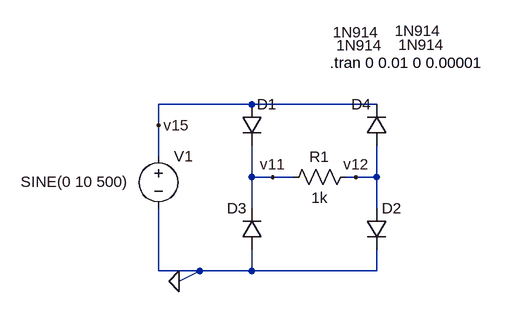
[diagram p0: schematic 20301378_Lab2_Full_Wave.asc]
20301378_Lab2_Full_Wave.asc, the LTspice schematic file:
Version 4
SHEET 1 880 680
WIRE 48 128 -96 128
WIRE 240 128 48 128
WIRE -96 160 -96 128
WIRE -96 208 -96 160
WIRE 48 240 48 192
WIRE 80 240 48 240
WIRE 112 240 80 240
WIRE 208 240 192 240
WIRE 240 240 240 192
WIRE 240 240 208 240
WIRE 48 288 48 240
WIRE 240 288 240 240
WIRE -96 384 -96 288
WIRE -32 384 -96 384
WIRE 48 384 48 352
WIRE 48 384 -32 384
WIRE 240 384 240 352
WIRE 240 384 48 384
WIRE -64 400 -32 384
FLAG -64 400 0
FLAG 80 240 v11
FLAG 208 240 v12
FLAG -96 160 v15
SYMBOL diode 32 128 R0
WINDOW 3 236 -113 Left 2
SYMATTR Value 1N914
SYMATTR InstName D1
SYMBOL diode 224 288 R0
WINDOW 3 -51 -271 Left 2
SYMATTR Value 1N914
SYMATTR InstName D2
SYMBOL diode 64 352 R180
WINDOW 0 24 64 Left 2
WINDOW 3 -185 315 Left 2
SYMATTR InstName D3
SYMATTR Value 1N914
SYMBOL diode 256 192 R180
WINDOW 0 24 64 Left 2
WINDOW 3 -89 156 Left 2
SYMATTR InstName D4
SYMATTR Value 1N914
SYMBOL res 96 256 R270
WINDOW 0 32 56 VTop 2
WINDOW 3 0 56 VBottom 2
SYMATTR InstName R1
SYMATTR Value 1k
SYMBOL voltage -96 192 R0
WINDOW 3 -212 55 Left 2
WINDOW 123 0 0 Left 0
WINDOW 39 0 0 Left 0
SYMATTR Value SINE(0 10 500)
SYMATTR InstName V1
TEXT 168 64 Left 2 !.tran 0 0.01 0 0.00001
LINE Normal 48 288 48 288 2

The netlist it stands for:
* 20301378_Lab2_Full_Wave.asc
D1 v15 v11 1N914
D2 v12 0 1N914
D3 0 v11 1N914
D4 v12 v15 1N914
R1 v11 v12 1k
V1 v15 0 SINE(0 10 500)
.model D D
.lib standard.dio
.tran 0 0.01 0 0.00001
.backanno
.end

* Results of the author's LTspice run, read from the files saved beside the schematic
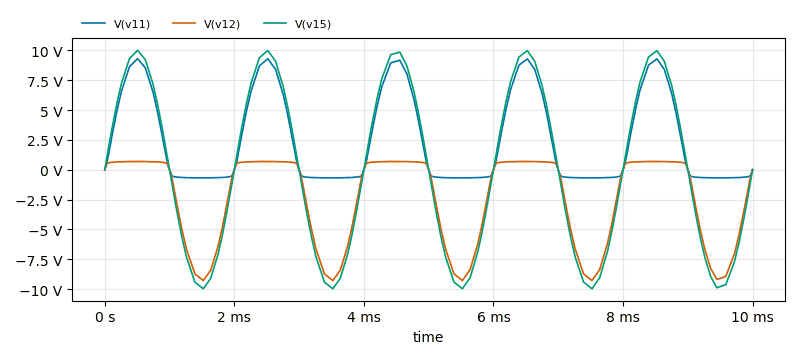
[diagram p1: Transient Analysis of 20301378_Lab2_Full_Wave.asc, plotted from the saved traces]
* Transient Analysis, 1 run:
*   V(v11): min -686.6 mV, max 9.309 V, average 2.525 V, rms 4.563 V, last -7.328 µV
*   V(v12): min -9.291 V, max 686.7 mV, average -2.526 V, rms 4.564 V, last 7.327 µV
*   V(v15): min -9.98 V, max 9.998 V, average -817.9 µV, rms 7.019 V, last 0 V